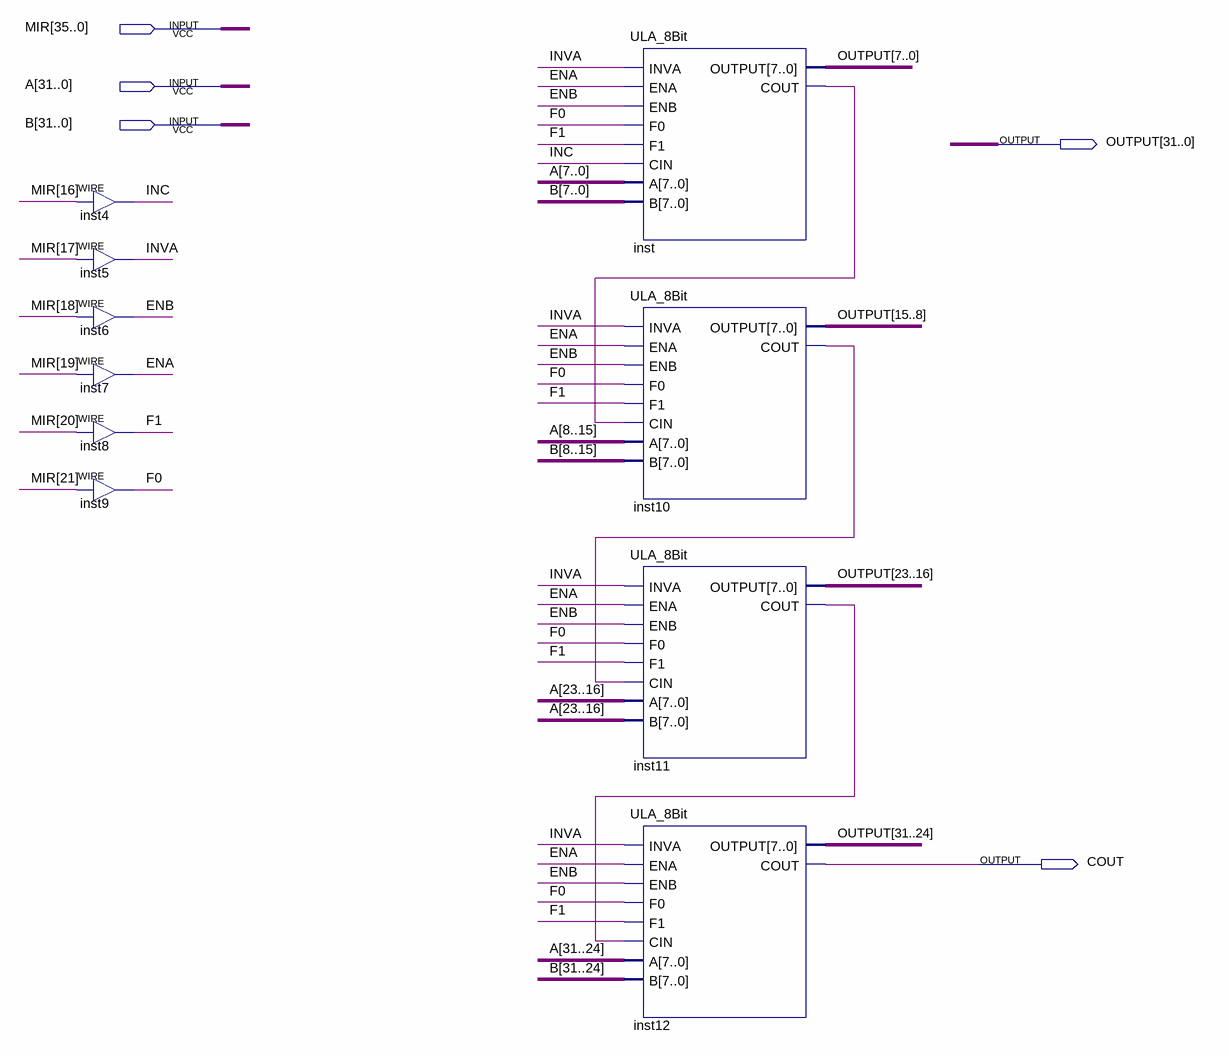
[diagram p0: schematic sheet]
// Quartus schematic ULA_32bit.bdf as structural Verilog: 10 symbols, 5 pins
module ULA_32bit (
  input  [35:0] MIR,
  input  [31:0] A,
  input  [31:0] B,
  output [31:0] OUTPUT,
  output COUT
);

  wire ENA, ENB, F0, F1, INC, inst10_cout, inst11_cout, inst_cout, INVA;

  assign INC = MIR[16];  // WIRE inst4
  assign INVA = MIR[17];  // WIRE inst5
  assign ENB = MIR[18];  // WIRE inst6
  assign ENA = MIR[19];  // WIRE inst7
  assign F1 = MIR[20];  // WIRE inst8
  assign F0 = MIR[21];  // WIRE inst9
  ULA_8Bit inst (
    .INVA(INVA), .ENA(ENA), .ENB(ENB), .F0(F0), .F1(F1), .CIN(INC), .A(A[7:0]), .B(B[7:0]),
    .OUTPUT(OUTPUT[7:0]), .COUT(inst_cout));
  ULA_8Bit inst10 (
    .INVA(INVA), .ENA(ENA), .ENB(ENB), .F0(F0), .F1(F1), .CIN(inst_cout),
    .A({A[8], A[9], A[10], A[11], A[12], A[13], A[14], A[15]}),
    .B({B[8], B[9], B[10], B[11], B[12], B[13], B[14], B[15]}), .OUTPUT(OUTPUT[15:8]), .COUT(inst10_cout));
  ULA_8Bit inst11 (
    .INVA(INVA), .ENA(ENA), .ENB(ENB), .F0(F0), .F1(F1), .CIN(inst10_cout), .A(A[23:16]), .B(A[23:16]),
    .OUTPUT(OUTPUT[23:16]), .COUT(inst11_cout));
  ULA_8Bit inst12 (
    .INVA(INVA), .ENA(ENA), .ENB(ENB), .F0(F0), .F1(F1), .CIN(inst11_cout), .A(A[31:24]), .B(B[31:24]),
    .OUTPUT(OUTPUT[31:24]), .COUT(COUT));
endmodule
